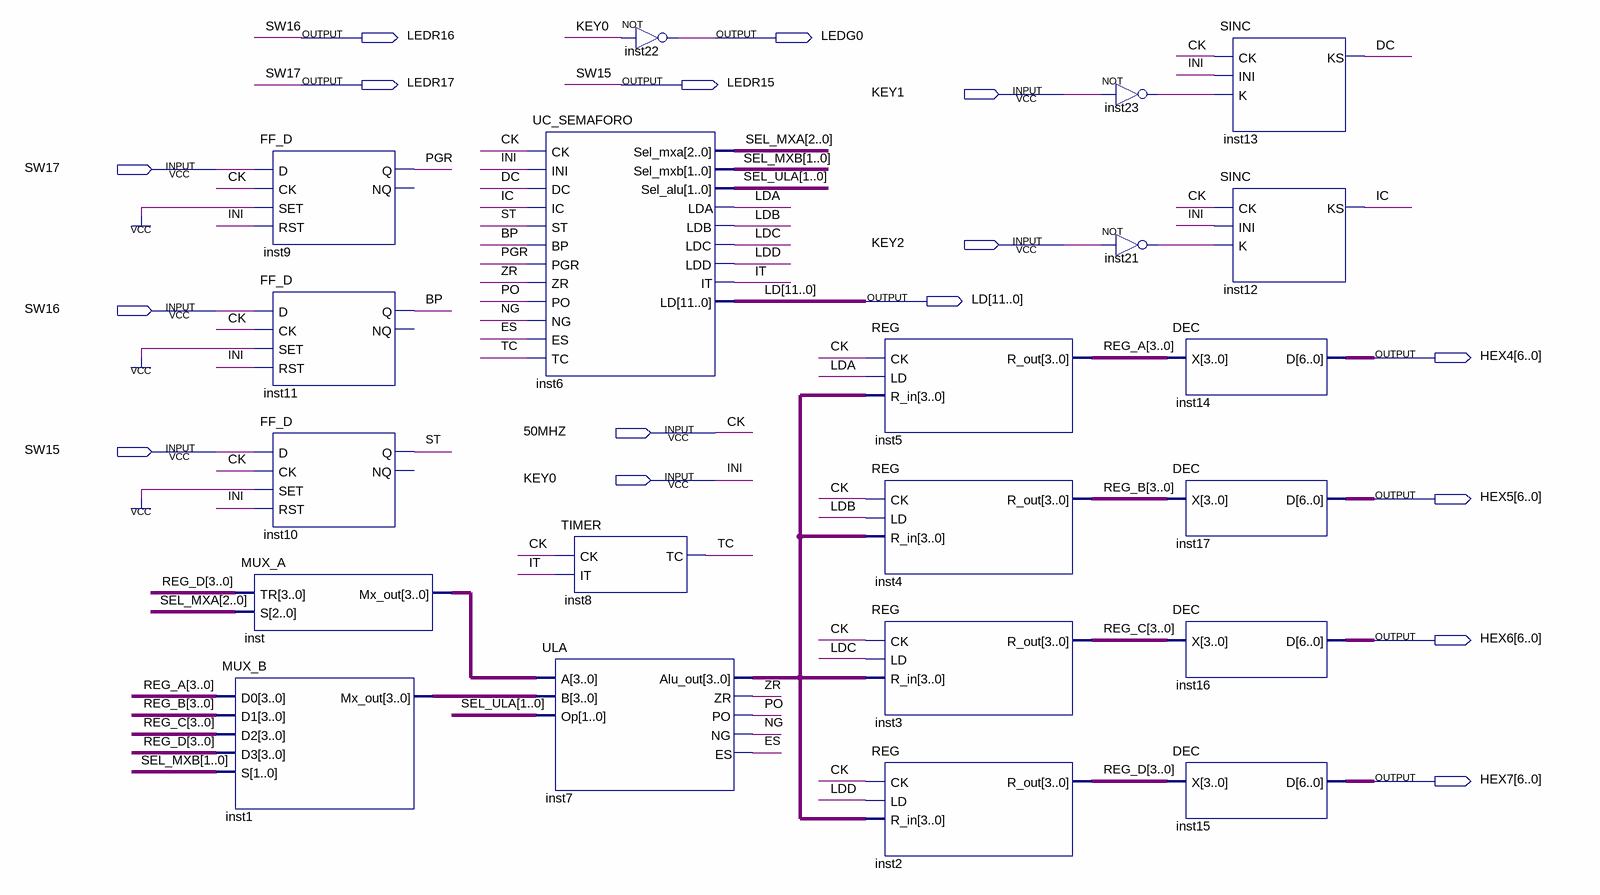
[diagram p0: schematic sheet]
// Quartus schematic projeto_2.bdf as structural Verilog: 21 symbols, 16 pins
module projeto_2 (
  input  KEY1,
  input  SW17,
  input  KEY2,
  input  SW16,
  input  \50MHZ ,
  input  SW15,
  input  KEY0,
  output LEDR16,
  output LEDG0,
  output LEDR17,
  output LEDR15,
  output [11:0] LD,
  output [6:0] HEX4,
  output [6:0] HEX5,
  output [6:0] HEX6,
  output [6:0] HEX7
);

  wire BP, DC, ES, IC, inst21_out, inst23_out, IT, LDA, LDB, LDC, LDD, NG, PGR, PO, ST, TC, ZR;
  wire [1:0] SEL_MXB, SEL_ULA;
  wire [2:0] SEL_MXA;
  wire [3:0] inst1_mx_out, inst7_alu_out, inst_mx_out, REG_A, REG_B, REG_C, REG_D;

  FF_D inst9 (.D(SW17), .CK(\50MHZ ), .SET(1'b1), .RST(KEY0), .Q(PGR));  // open: NQ
  FF_D inst11 (.D(SW16), .CK(\50MHZ ), .SET(1'b1), .RST(KEY0), .Q(BP));  // open: NQ
  FF_D inst10 (.D(SW15), .CK(\50MHZ ), .SET(1'b1), .RST(KEY0), .Q(ST));  // open: NQ
  MUX_A inst (.TR(REG_D), .S(SEL_MXA), .Mx_out(inst_mx_out));
  MUX_B inst1 (.D0(REG_A), .D1(REG_B), .D2(REG_C), .D3(REG_D), .S(SEL_MXB), .Mx_out(inst1_mx_out));
  UC_SEMAFORO inst6 (
    .CK(\50MHZ ), .INI(KEY0), .DC(DC), .IC(IC), .ST(ST), .BP(BP), .PGR(PGR), .ZR(ZR), .PO(PO), .NG(NG),
    .ES(ES), .TC(TC), .Sel_mxa(SEL_MXA), .Sel_mxb(SEL_MXB), .Sel_alu(SEL_ULA), .LDA(LDA), .LDB(LDB),
    .LDC(LDC), .LDD(LDD), .IT(IT), .LD(LD));
  TIMER inst8 (.CK(\50MHZ ), .IT(IT), .TC(TC));
  ULA inst7 (
    .A(inst_mx_out), .B(inst1_mx_out), .Op(SEL_ULA), .Alu_out(inst7_alu_out), .ZR(ZR), .PO(PO), .NG(NG),
    .ES(ES));
  not inst22 (LEDG0, KEY0);
  REG inst5 (.CK(\50MHZ ), .LD(LDA), .R_in(inst7_alu_out), .R_out(REG_A));
  REG inst4 (.CK(\50MHZ ), .LD(LDB), .R_in(inst7_alu_out), .R_out(REG_B));
  REG inst3 (.CK(\50MHZ ), .LD(LDC), .R_in(inst7_alu_out), .R_out(REG_C));
  REG inst2 (.CK(\50MHZ ), .LD(LDD), .R_in(inst7_alu_out), .R_out(REG_D));
  not inst23 (inst23_out, KEY1);
  not inst21 (inst21_out, KEY2);
  DEC inst14 (.X(REG_A), .D(HEX4));
  DEC inst17 (.X(REG_B), .D(HEX5));
  DEC inst16 (.X(REG_C), .D(HEX6));
  DEC inst15 (.X(REG_D), .D(HEX7));
  SINC inst13 (.CK(\50MHZ ), .INI(KEY0), .K(inst23_out), .KS(DC));
  SINC inst12 (.CK(\50MHZ ), .INI(KEY0), .K(inst21_out), .KS(IC));

  assign LEDR15 = SW15;
  assign LEDR16 = SW16;
  assign LEDR17 = SW17;

  // Other names for the same wires on the sheet: CK = \50MHZ ; INI = KEY0
endmodule
